# Altium schematic sheet mux.SchDoc
size A
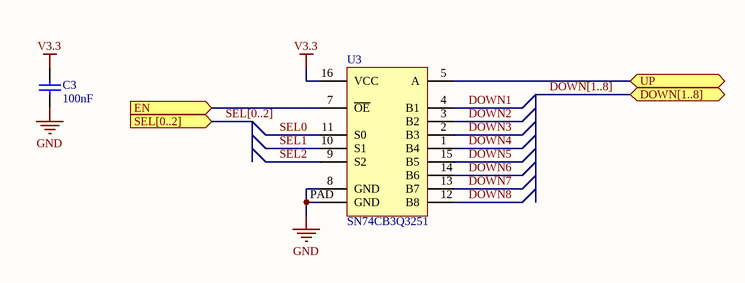
[diagram p0: mux.SchDoc]

## Parts
C3  100nF  [0402]
U3  SN74CB3Q3251  [TI_RGY]

## Ports
DOWN[1..8] (bidir), EN (in), SEL[0..2] (in), UP (bidir)

## Nets
GND: C3.1 U3.8(GND) U3.PAD(GND)
V3.3: C3.2 U3.16(VCC)
DOWN1: U3.4(B1)
DOWN2: U3.3(B2)
DOWN3: U3.2(B3)
DOWN4: U3.1(B4)
DOWN5: U3.15(B5)
DOWN6: U3.14(B6)
DOWN7: U3.13(B7)
DOWN8: U3.12(B8)
EN: U3.7(~{OE}) ; port EN
SEL0: U3.11(S0)
SEL1: U3.10(S1)
SEL2: U3.9(S2)
UP: U3.5(A) ; port UP

## Buses and harness runs
bus DOWN[1..8] = port DOWN[1..8]
bus SEL[0..2] = port SEL[0..2]

## Library data of the parts
C3 = Capacitor: Value: 100nF
U3 = SN74CB3Q3251: 1:8 Mux